# Altium schematic sheet Motor_Driver.SchDoc
size A
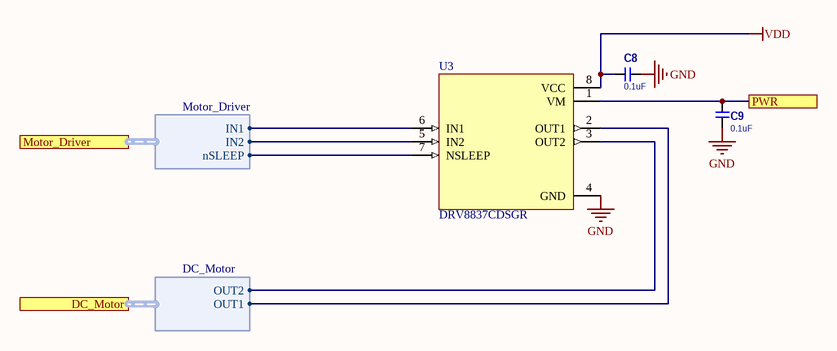
[diagram p0: Motor_Driver.SchDoc]

## Parts
C8  0.1uF  [0603-C]
C9  0.1uF  [0603-C]
U3  DRV8837CDSGR  [SON50P200X200X80-9N]

## Ports
DC_Motor (harness DC_Motor), Motor_Driver (harness Motor_Driver), PWR

## Harnesses
Motor_Driver: IN1, IN2, nSLEEP
DC_Motor: OUT1, OUT2

## Nets
GND: C8.2 C9.2 U3.4(GND)
VDD: C8.1 U3.8(VCC)
PWR: C9.1 U3.1(VM) ; port PWR
NetU3_2: U3.2(OUT1) ; port DC_Motor.OUT1
NetU3_3: U3.3(OUT2) ; port DC_Motor.OUT2
NetU3_5: U3.5(IN2) ; port Motor_Driver.IN2
NetU3_6: U3.6(IN1) ; port Motor_Driver.IN1
NetU3_7: U3.7(NSLEEP) ; port Motor_Driver.nSLEEP

## Library data of the parts
C8 C9 = CAP: Manufacturer: TDK EPCOS; Manufacturer Part Number: B37941K9105K62; Capacitance: 1uF; Voltage Rating: 16V; Tolerance: 10%; ComponentLink1URL: https://datasheet.ciiva.com/13389/upy-gphc-y5v-6-3v-to-50v-5-13389978.pdf?src-supplier=Mouser; ComponentLink1Description: Datasheet; Supplier 1: Digi-Key; RoHS: Yes; Category: Ceramic Capacitors; Mount: Surface Mount; Case/Package: 0805; Case Code (Metric): 2012; Case Code (Imperial): 0805; Min Operating Temperature: -55°C; Max Operating Temperature: 125°C; Package Quantity: 3000; Packaging: Tape and Reel; Voltage Rating (DC): 16V; Length: 0.079inch; Width: 0.049inch; Height: 1.35mm; Thickness: 0.049inch; Ratings: AEC-Q200; Lead Free: Lead Free; ComponentLink2URL: http://components.arrow.com/part/dataview/0323_01879911?src-supplier=Arrow+Europe; ComponentLink2Description: http://components.arrow.com/part/dataview/0323_01879911?src-supplier=Arrow+Europe; ComponentLink3URL: https://media.digikey.com/pdf/Data%20Sheets/Epcos%20PDFs/B37872K_B37941K_Series.pdf?src-supplier=Digi-Key; ComponentLink3Description: https://media.digikey.com/pdf/Data%20Sheets/Epcos%20PDFs/B37872K_B37941K_Series.pdf?src-supplier=Digi-Key; Supplier Part Number 1: 495-1935-1-ND
U3 = DRV8837CDSGR: 11-V, 1-A H-bridge motor driver 8-WSON -40 to 85; MF: Texas Instruments; Mouser-Purchase-URL: https://snapeda.com/shop?store=Mouser&id=617854; Value: *; DigiKey-Purchase-URL: https://snapeda.com/shop?store=DigiKey&id=617854; Package: WSON-8 Texas Instruments; Texas_Instruments-Purchase-URL: https://snapeda.com/shop?store=Texas+Instruments&id=617854; Price: None; MP: DRV8837CDSGR; SnapEDA_Link: https://www.snapeda.com/parts/DRV8837CDSGR/Texas%20Instruments/view-part/617854/?ref=snap; Availability: Good